# Altium schematic sheet Sheet1.SchDoc
size A; SheetNumber: 1; SheetTotal: 4; SPICEModelCacheTQPEDXUI: <root> / <DocumentId>TQPEDXUI</DocumentId> / </root>
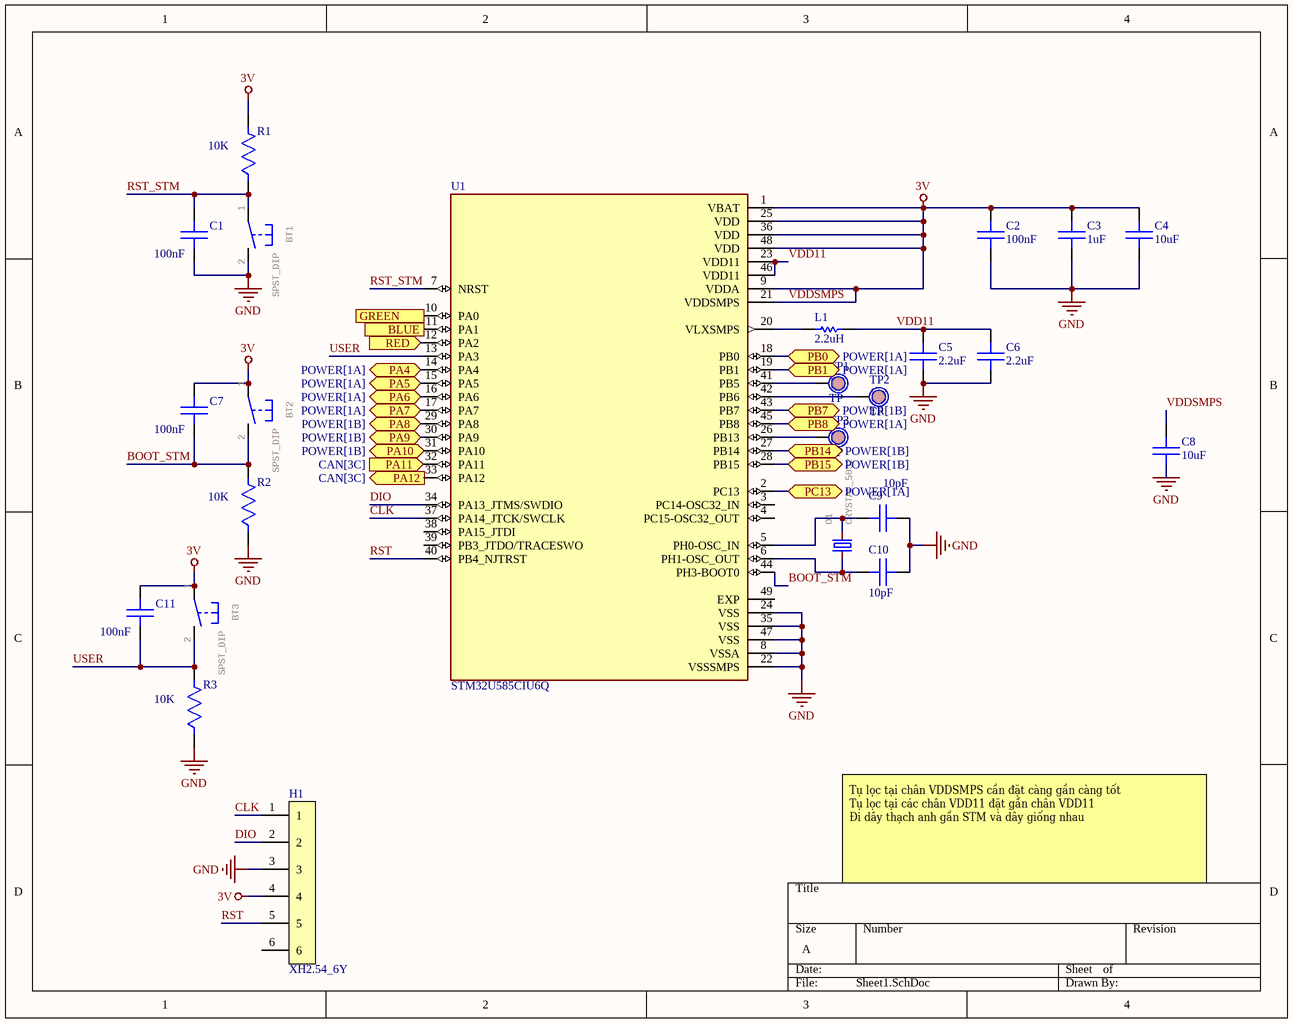
[diagram p0: Sheet1.SchDoc]

## Parts
BT1  SPST_DIP  [SPST_BUTTON_2DIP]
BT2  SPST_DIP  [SPST_BUTTON_2DIP]
BT3  SPST_DIP  [SPST_BUTTON_2DIP]
C1  100nF  [C0603]
C2  100nF  [C0603]
C3  1uF  [C0603]
C4  10uF  [C0603]
C5  2.2uF  [C0603]
C6  2.2uF  [C0603]
C7  100nF  [C0603]
C8  10uF  [C0603]
C9  10pF  [C0603]
C10  10pF  [C0603]
C11  100nF  [C0603]
H1  XH2.54_6Y  [JST-XH-06-PACKAGE-LONG-PAD]
L1  2.2uH  [Res 1206 SMD]
O1  CRYSTAL_5032  [CRYSTAL_5032]
R1  10K  [R0603]
R2  10K  [R0603]
R3  10K  [R0603]
TP1  TP  [Test_point_SMD]
TP2  TP  [Test_point_SMD]
TP3  TP  [Test_point_SMD]
U1  STM32U585CIU6Q  [QFN50P700X700X60-49N]

## Ports
BLUE (in, see LED RGBSchDoc[2B], LED RGBSchDoc[2C], LED RGBSchDoc[3A], LED RGBSchDoc[3B], LED RGBSchDoc[3C]), GREEN (in, see LED RGBSchDoc[1B], LED RGBSchDoc[1C], LED RGBSchDoc[3B], LED RGBSchDoc[3C]), PA4 (bidir, see POWER[1A]), PA5 (bidir, see POWER[1A]), PA6 (bidir, see POWER[1A]), PA7 (bidir, see POWER[1A]), PA8 (bidir, see POWER[1B]), PA9 (bidir, see POWER[1B]), PA10 (bidir, see POWER[1B]), PA11 (in, see CAN[3C]), PA12 (out, see CAN[3C]), PB0 (bidir, see POWER[1A]), PB1 (bidir, see POWER[1A]), PB7 (bidir, see POWER[1B]), PB8 (bidir, see POWER[1A]), PB14 (bidir, see POWER[1B]), PB15 (bidir, see POWER[1B]), PC13 (bidir, see POWER[1A]), RED (in, see LED RGBSchDoc[2B], LED RGBSchDoc[2C], LED RGBSchDoc[3A], LED RGBSchDoc[3B], LED RGBSchDoc[3C])

## Nets
GND: BT1.2 C1.1 C2.1 C3.1 C4.1 C5.1 C6.1 C8.2 C9.2 C10.2 H1.3 R2.1 R3.1 U1.8(VSSA) U1.22(VSSSMPS) U1.24(VSS) U1.35(VSS) U1.47(VSS)
VDDSMPS: BT2.1 BT3.1 C2.2 C3.2 C4.2 C7.2 C8.1 C11.2 H1.4 R1.2 U1.1(VBAT) U1.9(VDDA) U1.21(VDDSMPS) U1.25(VDD) U1.36(VDD) U1.48(VDD)  [also labelled 3V]
BLUE: U1.11(PA1) ; port BLUE
BOOT_STM: BT2.2 C7.1 R2.2 U1.44(PH3-BOOT0)
CLK: H1.1 U1.37(PA14_JTCK/SWCLK)
DIO: H1.2 U1.34(PA13_JTMS/SWDIO)
GREEN: U1.10(PA0) ; port GREEN
PA4: U1.14(PA4) ; port PA4
PA5: U1.15(PA5) ; port PA5
PA6: U1.16(PA6) ; port PA6
PA7: U1.17(PA7) ; port PA7
PA8: U1.29(PA8) ; port PA8
PA9: U1.30(PA9) ; port PA9
PA10: U1.31(PA10) ; port PA10
PA11: U1.32(PA11) ; port PA11
PA12: U1.33(PA12) ; port PA12
PB0: U1.18(PB0) ; port PB0
PB1: U1.19(PB1) ; port PB1
PB7: U1.43(PB7) ; port PB7
PB8: U1.45(PB8) ; port PB8
PB14: U1.27(PB14) ; port PB14
PB15: U1.28(PB15) ; port PB15
PC13: U1.2(PC13) ; port PC13
RED: U1.12(PA2) ; port RED
RST: H1.5 U1.40(PB4_NJTRST)
RST_STM: BT1.1 C1.2 R1.1 U1.7(NRST)
USER: BT3.2 C11.1 R3.2 U1.13(PA3)
VDD11: C5.2 C6.2 L1.2 U1.23(VDD11) U1.46(VDD11)
NetC9_1: C9.1 O1.2 U1.5(PH0-OSC_IN)
NetC10_1: C10.1 O1.1 U1.6(PH1-OSC_OUT)
NetL1_1: L1.1 U1.20(VLXSMPS)
NetTP1_1: TP1.1 U1.41(PB5)
NetTP2_1: TP2.1 U1.42(PB6)
NetTP3_1: TP3.1 U1.26(PB13)

Not connected (* = marked no-connect by the designer): H1 6; U1 3(PC14-OSC32_IN) 4(PC15-OSC32_OUT) 38(PA15_JTDI) 39(PB3_JTDO/TRACESWO) 49(EXP)

## Notes on the sheet
- Tụ lọc tại chân VDDSMPS cần đặt càng gần càng tốt
  Tụ lọc tại các chân VDD11 đặt gần chân VDD11
  Đi dây thạch anh gần STM và dây giống nhau

## Library data of the parts
BT1-BT3 = SPST_DIP: GateName_1: G$1; SymbolName_1: BT1; DeviceSetName: BT4; LibraryName: Uy_SMD; Package: BT4
C1-C11 = Capacitor 0603
L1 = RES-1206: RES SMD 5.1 OHM 1% 1/4W 1206; Manufacturer: Yageo; Manufacturer Part Number: RC1206FR-075R1L; Resistance (Ohms): 5.1; Power (Watts): 0.25W, 1/4W; Temperature Coefficient: ±200ppm/°C; Supplier 1: Digi-Key; RoHS: RoHS Compliant; Category: Resistors; Stock 1: 96701; Pricing 1: 1=0.1, 10=0.051, 100=0.0207, 1000=0.0093, 2500=0.00807 (USD); Packaging: Cut Tape (CT); Part Status: Active; Tolerance: ±1%; Composition: Thick Film; Features: Moisture Resistant; Operating Temperature: -55°C ~ 155°C; Package / Case: 1206 (3216 Metric); Supplier Device Package: 1206; Size / Dimension: 0.122" L x 0.063" W (3.10mm x 1.60mm); Height - Seated (Max): 0.026" (0.65mm); Failure Rate: -; ComponentLink1URL: http://www.yageo.com/documents/recent/PYu-RC_Group_51_RoHS_L_7.pdf; ComponentLink1Description: http://www.yageo.com/documents/recent/PYu-RC_Group_51_RoHS_L_7.pdf; Supplier Part Number 1: 311-5.10FRCT-ND
O1 = CRYSTAL_5032: GateName_1: G$1; SymbolName_1: Q; DeviceName: -9B; LibraryName: Uy_SMD; DeviceSetName: CRYSTAL_5032; Package: 5.0X3.2_2
R1-R3 = Resistor 0603: SMD Resistor 0603; Manufacturer: Yageo; Manufacturer Part Number: RC0603FR-071KL; Power Rating: 100mW; Tolerance: 1%; Temperature Coefficient: 100ppm/°C; Voltage Rating: 50V; Supplier: Digi-Key; Supplier Part Number: 311-1.00KHRDKR-ND; RoHS: Yes; Category: Chip SMD Resistors; Stock: 18662657; Pricing: 1=0.1, 10=0.018, 50=0.0106, 100=0.0088, 500=0.00592, 1000=0.00505 (USD); Case/Package: 0603; Case Code (Imperial): 0603; Case Code (Metric): 1608; Contact Plating: Tin,Matte; Min Operating Temperature: -55°C; Max Operating Temperature: 155°C; Packaging: Tape and Reel; Resistor Type: Thick Film; Termination: SMD/SMT; Features: Moisture Resistant; Series: RC; Max Power Dissipation: 100mW; Number of Terminations: 2; Resistance Tolerance: 1%; Construction: Rectangular; Technology: THICK FILM; Length: 1.6mm; Height: 0.45mm; Depth: 0.8mm; Reach SVHC Compliant: No; Military Standard: Not; Lead Free: 5697LeadFree; RoHS Compliant: Yes
TP1-TP3 = Test_point_DNM: Test Point; Value: Test Point
U1 = STM32U585CIU6Q: ARM Microcontrollers - MCU Ultra-low-power FPU Arm Cortex-M33 Trust Zone, MCU 160 MHz 2Mbytes of Flash; MF: STMicroelectronics; SnapEDA_Link: https://www.snapeda.com/parts/STM32U585CIU6Q/STMicroelectronics/view-part/?ref=snap; Package: UFQFPN-48 STMicroelectronics; Value: *; MP: STM32U585CIU6Q; Check_prices: https://www.snapeda.com/parts/STM32U585CIU6Q/STMicroelectronics/view-part/?ref=eda